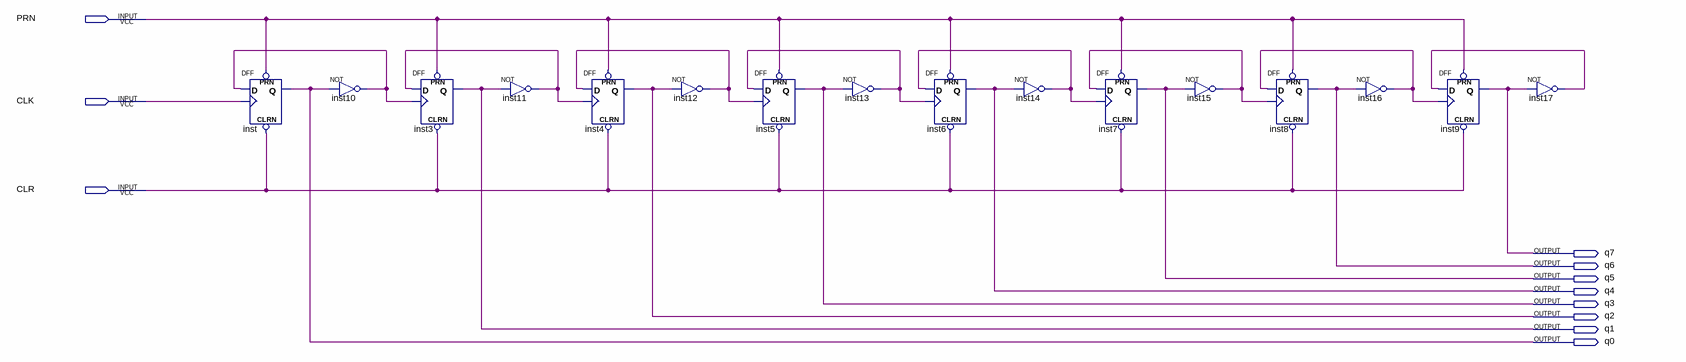
[diagram p0: schematic sheet]
// Quartus schematic upc.bdf as structural Verilog: 16 symbols, 11 pins
module upc (
  input  PRN,
  input  CLK,
  input  CLR,
  output q7,
  output q6,
  output q5,
  output q4,
  output q3,
  output q2,
  output q1,
  output q0
);

  wire inst10_out, inst11_out, inst12_out, inst13_out, inst14_out, inst15_out, inst16_out, inst17_out;

  DFF inst (.CLRN(CLR), .CLK(CLK), .D(inst10_out), .PRN(PRN), .Q(q0));
  not inst10 (inst10_out, q0);
  DFF inst3 (.CLRN(CLR), .CLK(inst10_out), .D(inst11_out), .PRN(PRN), .Q(q1));
  not inst11 (inst11_out, q1);
  DFF inst4 (.CLRN(CLR), .CLK(inst11_out), .D(inst12_out), .PRN(PRN), .Q(q2));
  not inst12 (inst12_out, q2);
  DFF inst5 (.CLRN(CLR), .CLK(inst12_out), .D(inst13_out), .PRN(PRN), .Q(q3));
  not inst13 (inst13_out, q3);
  DFF inst6 (.CLRN(CLR), .CLK(inst13_out), .D(inst14_out), .PRN(PRN), .Q(q4));
  not inst14 (inst14_out, q4);
  DFF inst7 (.CLRN(CLR), .CLK(inst14_out), .D(inst15_out), .PRN(PRN), .Q(q5));
  not inst15 (inst15_out, q5);
  DFF inst8 (.CLRN(CLR), .CLK(inst15_out), .D(inst16_out), .PRN(PRN), .Q(q6));
  not inst16 (inst16_out, q6);
  DFF inst9 (.CLRN(CLR), .CLK(inst16_out), .D(inst17_out), .PRN(PRN), .Q(q7));
  not inst17 (inst17_out, q7);
endmodule
